# EAGLE design alien (EAGLE 9.5.2)
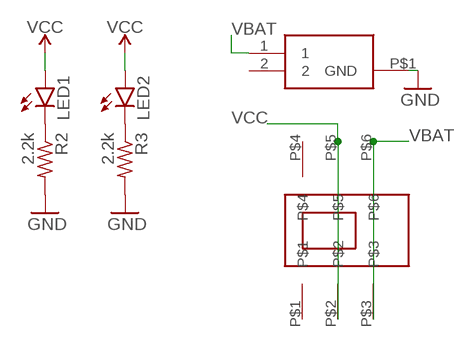
[diagram p0: schematic, sheet 1]

## Parts
LED1  LEDCHIP-LED0805  [CHIP-LED0805]
LED2  LEDCHIP-LED0805  [CHIP-LED0805]
R2  2.2k  R-US_R0603  [R0603]
R3  2.2k  R-US_R0603  [R0603]
U$1  CL-SB-22A-02T-SLIDE-SWITCH-TUCKED-PADS  [CL-SB-22A-02T-DPDT-COMPACT-SWITCH]
VBAT  BAT-HLD-012-SMT  [BATHLD012SMT]

## Nets
GND: R2.2 R3.2 VBAT.P$1(GND)
N$1: LED1.C R2.1
N$3: LED2.C R3.1
VBAT: U$1.P$3 U$1.P$6 VBAT.1
VCC: LED1.A LED2.A U$1.P$2 U$1.P$5
Unconnected: U$1.P$1 U$1.P$4 VBAT.2

## Library data of the parts
LED1 LED2 = led:LED: LED OSRAM: - CHIPLED LG R971, LG N971, LY N971, LG Q971, LY Q971, LO R971, LY R971 LH N974, LH R974 LS Q976, LO Q976, LY Q976 LO Q996 - Hyper CHIPLED LW Q18S LB Q993, LB Q99A, LB R99A - SideLED LS A670, LO A670, LY A670, LG A670, LP A670 LB A673, LV A673, LT A673, LW A673 LH A674 LY A675 LS A676, LA A676, LO A676, LY A676, LW A676 LS A679, LY A679, LG A679 - Hyper Micro SIDELED® LS Y876, LA Y876, LO Y876, LY Y876 LT Y87S - SmartLED LW L88C, LW L88S LB L89C, LB L89S, LG L890 LS L89K, LO L89K, LY L89K LS L896, LA L896, LO L896, LY L896 - TOPLED LS T670, LO T670, LY T670, LG T670, LP T670 LSG T670, LSP T670, LSY T670, LOP T670, LYG T670 LG T671, LOG T671, LSG T671 LB T673, LV T673, LT T673, LW T673 LH T674 LS T676, LA T676, LO T676, LY T676, LB T676, LH T676, LSB T676, LW T676 LB T67C, LV T67C, LT T67C, LS T67K, LO T67K, LY T67K, LW E67C LS E67B, LA E67B, LO E67B, LY E67B, LB E67C, LV E67C, LT E67C LW T67C LS T679, LY T679, LG T679 LS T770, LO T770, LY T770, LG T770, LP T770 LB T773, LV T773, LT T773, LW T773 LH T774 LS E675, LA E675, LY E675, LS T675 LS T776, LA T776, LO T776, LY T776, LB T776 LHGB T686 LT T68C, LB T68C - Hyper Mini TOPLED® LB M676 - Mini TOPLED Santana® LG M470 LS M47K, LO M47K, LY M47K Source: http://www.osram.convergy.de LUXEON: - LUMILED® LXK2-PW12-R00, LXK2-PW12-S00, LXK2-PW14-U00, LXK2-PW14-V00 LXK2-PM12-R00, LXK2-PM12-S00, LXK2-PM14-U00 LXK2-PE12-Q00, LXK2-PE12-R00, LXK2-PE12-S00, LXK2-PE14-T00, LXK2-PE14-U00 LXK2-PB12-K00, LXK2-PB12-L00, LXK2-PB12-M00, LXK2-PB14-N00, LXK2-PB14-P00, LXK2-PB14-Q00 LXK2-PR12-L00, LXK2-PR12-M00, LXK2-PR14-Q00, LXK2-PR14-R00 LXK2-PD12-Q00, LXK2-PD12-R00, LXK2-PD12-S00 LXK2-PH12-R00, LXK2-PH12-S00 LXK2-PL12-P00, LXK2-PL12-Q00, LXK2-PL12-R00 Source: www.luxeon.com KINGBRIGHT: KA-3528ASYC Source: www.kingbright.com
R2 R3 = rcl:R-US_: RESISTOR, American symbol; SPICEPREFIX: R
U$1 = electroninks:CL-SB-22A-02T-SLIDE-SWITCH-TUCKED-PADS
VBAT = SamacSys_Parts:BAT-HLD-012-SMT: Coin Cell Battery Holders Bat Hld CR1216/1225 Surface Mount Source: Datasheet <https://componentsearchengine.com/Datasheets/1/BAT-HLD-012-SMT.pdf>; DESCRIPTION: Coin Cell Battery Holders Bat Hld CR1216/1225 Surface Mount; HEIGHT: 3mm; MANUFACTURER_NAME: Linx Technologies; MANUFACTURER_PART_NUMBER: BAT-HLD-012-SMT; MOUSER_PART_NUMBER: 712-BAT-HLD-012-SMT; MOUSER_PRICE-STOCK: https://www.mouser.com/Search/Refine.aspx?Keyword=712-BAT-HLD-012-SMT

## Board
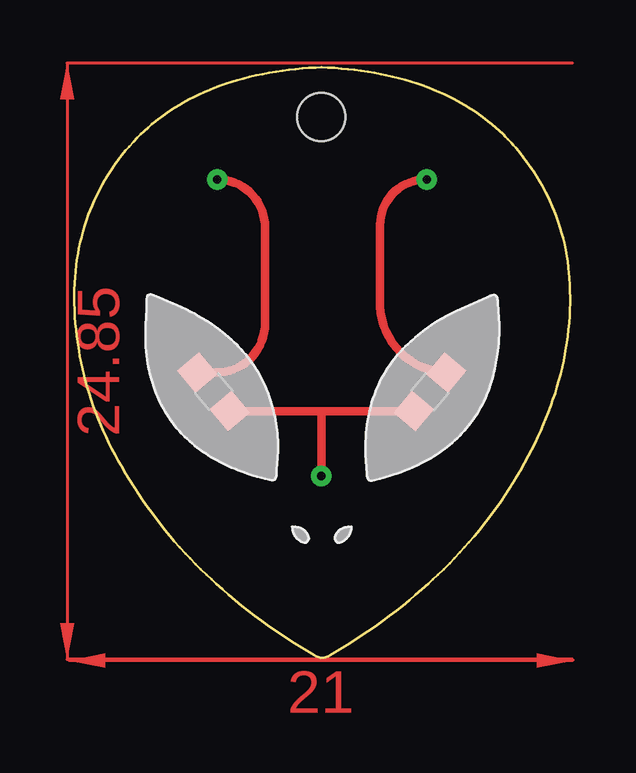
[diagram p1: board, top side]
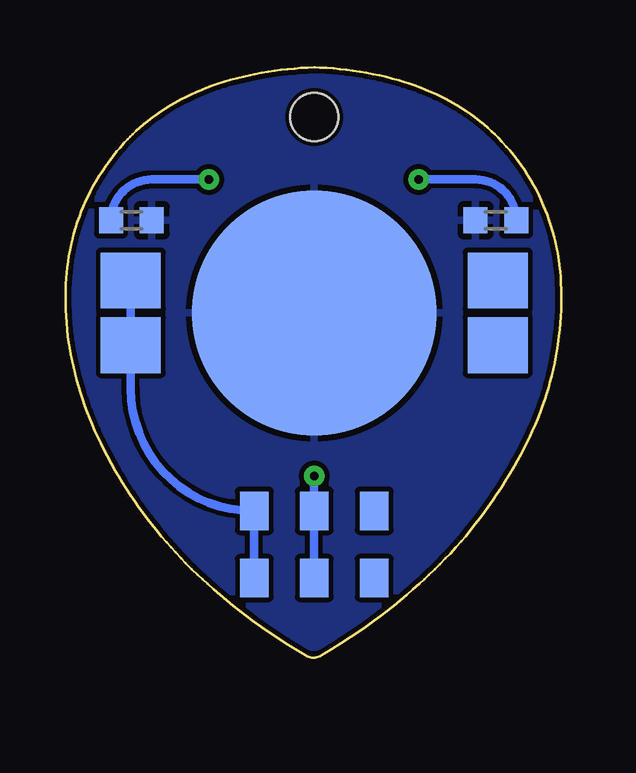
[diagram p2: board, bottom side, seen from below]

Size 20.68 x 24.6 mm. Coordinates in mm from the lower left corner, seen from the top.
Outline: 10.34,0 10.27,0.01 10.2,0.02 10.07,0.07 10.01,0.1 9.59,0.35 9.18,0.61 8.77,0.87 8.43,1.11 8.14,1.3 7.81,1.55 7.53,1.75 7.25,1.97 6.98,2.18 6.71,2.4 6.44,2.62 6.18,2.85 5.92,3.08 5.72,3.27 5.51,3.46 5.26,3.7 5.07,3.89 4.83,4.14 4.64,4.35 4.4,4.6 4.17,4.86 3.99,5.07 3.77,5.34 3.6,5.56 3.38,5.83 3.22,6.06 3.06,6.28 2.86,6.57 2.7,6.8 2.51,7.09 2.29,7.44 2.14,7.68 1.97,7.98 1.83,8.22 1.7,8.46 1.57,8.71 1.44,8.95 1.32,9.2 1.2,9.46 1.09,9.71 0.99,9.97 0.89,10.23 0.79,10.49 0.7,10.75 0.61,11.01 0.53,11.28 0.48,11.48 0.41,11.75 0.34,12.02 0.28,12.29 0.23,12.57 0.19,12.77 0.15,13.05 0.11,13.39 0.07,13.67 0.05,13.94 0.03,14.22 0.01,14.5 0,14.77 0,15.05 0,15.33 0.02,15.61 0.03,15.89 0.05,16.09 0.08,16.37 0.11,16.58 0.15,16.85 0.19,17.06 0.25,17.33 0.3,17.53 0.37,17.8 0.43,18 0.52,18.26 0.59,18.46 0.66,18.65 0.74,18.85 0.83,19.04 0.94,19.29 1.07,19.54 1.17,19.72 1.27,19.9 1.42,20.14 1.53,20.31 1.69,20.54 1.85,20.77 1.98,20.93 2.15,21.15 2.29,21.31 2.47,21.51 2.62,21.66 2.77,21.81 2.92,21.95 3.07,22.09 3.23,22.23 3.39,22.36 3.5,22.44 3.61,22.53 3.78,22.65 3.95,22.77 4.18,22.92 4.36,23.03 4.54,23.13 4.79,23.27 4.97,23.36 5.22,23.48 5.41,23.57 5.67,23.68 5.86,23.75 6.12,23.85 6.32,23.92 6.58,24 6.78,24.06 7.05,24.14 7.32,24.2 7.59,24.27 7.86,24.32 8.13,24.38 8.41,24.42 8.68,24.46 8.95,24.5 9.23,24.53 9.51,24.56 9.78,24.58 10.06,24.59 10.3,24.6 10.58,24.59 10.86,24.58 11.14,24.56 11.41,24.53 11.69,24.5 11.96,24.46 12.24,24.42 12.51,24.38 12.78,24.32 12.99,24.28 13.26,24.22 13.53,24.15 13.8,24.08 14.06,24 14.33,23.92 14.52,23.85 14.78,23.75 14.98,23.68 15.23,23.57 15.42,23.48 15.67,23.36 15.86,23.27 16.1,23.14 16.28,23.03 16.52,22.89 16.7,22.77 16.87,22.66 17.04,22.53 17.15,22.45 17.26,22.36 17.42,22.23 17.58,22.1 17.73,21.96 17.88,21.81 17.98,21.72 18.08,21.62 18.22,21.47 18.32,21.36 18.41,21.26 18.54,21.1 18.71,20.88 18.88,20.66 19,20.49 19.16,20.26 19.27,20.08 19.41,19.85 19.52,19.67 19.65,19.42 19.74,19.23 19.83,19.05 19.94,18.79 20.02,18.6 20.1,18.4 20.19,18.14 20.25,17.94 20.33,17.68 20.38,17.47 20.45,17.2 20.49,17 20.54,16.73 20.57,16.52 20.61,16.24 20.63,16.04 20.65,15.83 20.66,15.55 20.67,15.27 20.68,15 20.67,14.79 20.67,14.51 20.65,14.23 20.63,13.95 20.61,13.68 20.58,13.4 20.54,13.13 20.51,12.92 20.46,12.65 20.4,12.37 20.34,12.1 20.28,11.83 20.21,11.56 20.13,11.3 20.05,11.03 19.96,10.77 19.87,10.5 19.77,10.24 19.67,9.98 19.57,9.73 19.45,9.47 19.34,9.22 19.22,8.97 19.07,8.66 18.94,8.41 18.77,8.1 18.6,7.8 18.46,7.56 18.32,7.33 18.13,7.03 17.98,6.8 17.78,6.51 17.62,6.28 17.42,6 17.25,5.78 17.08,5.56 16.91,5.34 16.69,5.08 16.46,4.81 16.28,4.6 16.09,4.4 15.85,4.15 15.66,3.95 15.41,3.7 15.16,3.46 14.96,3.27 14.76,3.08 14.5,2.85 14.24,2.62 13.97,2.4 13.7,2.18 13.43,1.97 13.15,1.76 12.87,1.55 12.53,1.31 12.25,1.11 11.9,0.87 11.49,0.61 11.08,0.35 10.67,0.1 10.61,0.07 10.47,0.02 10.41,0.01 10.34,0
Copper layers (1*16): Top 0.035mm / dielectric 1.5mm / Bottom 0.035mm
Design rules "SparkFun *": minimum track width 8mil, minimum drill 20mil, track to track 8mil, track to pad 8mil, pad to pad 8mil, via to via 8mil, smd to smd 8mil, copper to edge 8mil, drill to drill 8mil, minimum pad ring 12mil, minimum via ring 10mil, stop-mask expansion 4mil, vias tented up to drill 0.4mm, thermal gap 10mil
Holes 2 mm at 10.31,22.53

### Footprints (pad centres in the part's own frame; a part is rotated, then mirrored left to right if it is on the bottom)
CHIP-LED0805 = smd 1.2 x 1.2: A 0,-1.05; C 0,1.05
R0603 = smd 1 x 1.1: 1 -0.85,0; 2 0.85,0
CL-SB-22A-02T-DPDT-COMPACT-SWITCH = smd 1.2 x 1.6: P$1 -2.5,-1.4; P$2 0,-1.4; P$3 2.5,-1.4; P$4 -2.5,1.4; P$5 0,1.4; P$6 2.5,1.4
BATHLD012SMT = smd 2.5 x 2.325: 1 -7.65,1.35; 2 7.65,1.35; P$2 -7.65,-1.35; P$3 7.65,-1.35 | smd 10.2 x 10.2: P$1 0,0

### Placement (x,y rotation side)
LED1  5.81,11.08 40 top
LED2  14.83,11.08 320 top
R2  2.73,18.23 180 bottom
R3  17.93,18.23 0 bottom
U$1  10.31,4.73 180 bottom
VBAT  10.31,14.37 0 bottom

### Tracks (layer width: path | path; a pad name or v marks a point on that pad's centre or on a via)
GND
  pour Bottom: -0.22,24.78 20.78,24.78 20.78,-0.07 -0.22,-0.07
N$1  (via drill 0.35 pad 0.8)
  Top 0.35: v5.96,19.93 arc-90 7.96,17.93 7.96,13.93 arc-90 5.91,11.89 LED1.C
  Bottom 0.35: R2.1 arc-90 3.58,19.93 v5.96,19.93
N$3  (via drill 0.35 pad 0.8)
  Top 0.35: LED2.C arc-90 12.75,14.92 12.75,18.03 arc-90 14.65,19.93 v14.7,19.93
  Bottom 0.35: R3.1 arc90 17.08,19.93 v14.7,19.93
VBAT
  Bottom 0.35: VBAT.1 17.96,11.21 arc-90 12.88,6.13 U$1.P$3 U$1.P$6
VCC  (via drill 0.35 pad 0.8)
  Top 0.35: LED1.A 10.31,10.28 | 10.31,10.28 LED2.A | v10.31,7.57 10.31,10.28
  Bottom 0.35: U$1.P$5 U$1.P$2 v10.31,7.57
(copper drawn outside any net)
  shapes: Top area x2